# EAGLE design Counting Box (EAGLE 8.5.1)
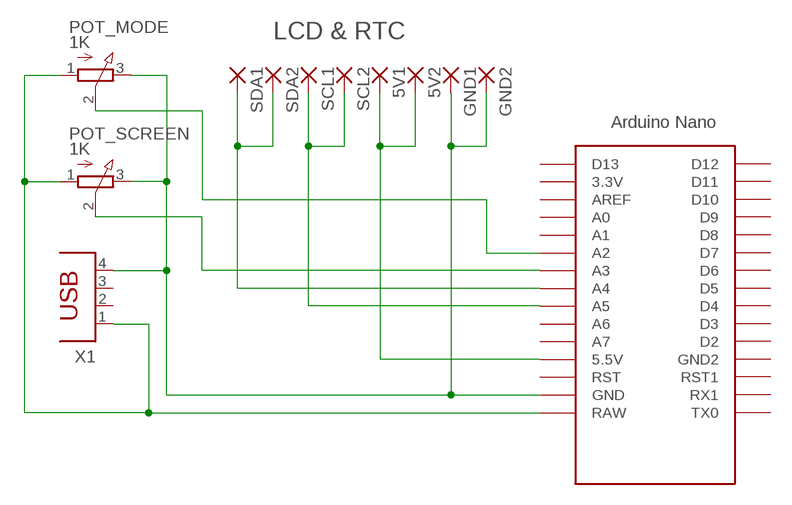
[diagram p0: schematic, sheet 1]

## Parts
5V1  SMD2  [SMD1,27-2,54]
5V2  SMD2  [SMD1,27-2,54]
GND1  SMD2  [SMD1,27-2,54]
GND2  SMD2  [SMD1,27-2,54]
POT_MODE  1K  3RP/1610N  [3RP/1610N]
POT_SCREEN  1K  3RP/1610N  [3RP/1610N]
SCL1  SMD2  [SMD1,27-2,54]
SCL2  SMD2  [SMD1,27-2,54]
SDA1  SMD2  [SMD1,27-2,54]
SDA2  SMD2  [SMD1,27-2,54]
U$1  NANO  [NANO]
X1  PN87520  [PN87520]

## Nets
5V: 5V1.1(P) 5V2.1(P) U$1.5V(5.5V)
GND: GND1.1(P) GND2.1(P) POT_MODE.3(E) POT_SCREEN.3(E) U$1.GND X1.4
POT_MODE: POT_MODE.2(S) U$1.A2
POT_SCREEN: POT_SCREEN.2(S) U$1.A3
SCL: SCL1.1(P) SCL2.1(P) U$1.A5
SDA: SDA1.1(P) SDA2.1(P) U$1.A4
VCC: POT_MODE.1(A) POT_SCREEN.1(A) U$1.RAW X1.1
Unconnected: U$1.3.3V U$1.A0 U$1.A1 U$1.A6 U$1.A7 U$1.AREF U$1.D2 U$1.D3 U$1.D4 U$1.D5 U$1.D6 U$1.D7 U$1.D8 U$1.D9 U$1.D10 U$1.D11 U$1.D12 U$1.D13 U$1.GND1(GND2) U$1.ICSP1 U$1.ICSP2 U$1.ICSP3 U$1.ICSP4 U$1.ICSP5 U$1.ICSP6 U$1.RST U$1.RST1 U$1.RX1 U$1.TX0 X1.2 X1.3

## Notes on the sheet
- LCD & RTC

## Library data of the parts
5V1 5V2 GND1 GND2 SCL1 SCL2 SDA1 SDA2 = wirepad:SMD2: SMD PAD
POT_MODE POT_SCREEN = pot:3RP/1610N: 16mm Potentiometer one level Source: http://www.alphapotentiometers.net/html/16mm_pot_2.html
U$1 = Arduino-clone:NANO: Arduino Nano
X1 = con-berg:PN87520: BERG USB connector; OC_FARNELL: unknown; OC_NEWARK: unknown

## Board
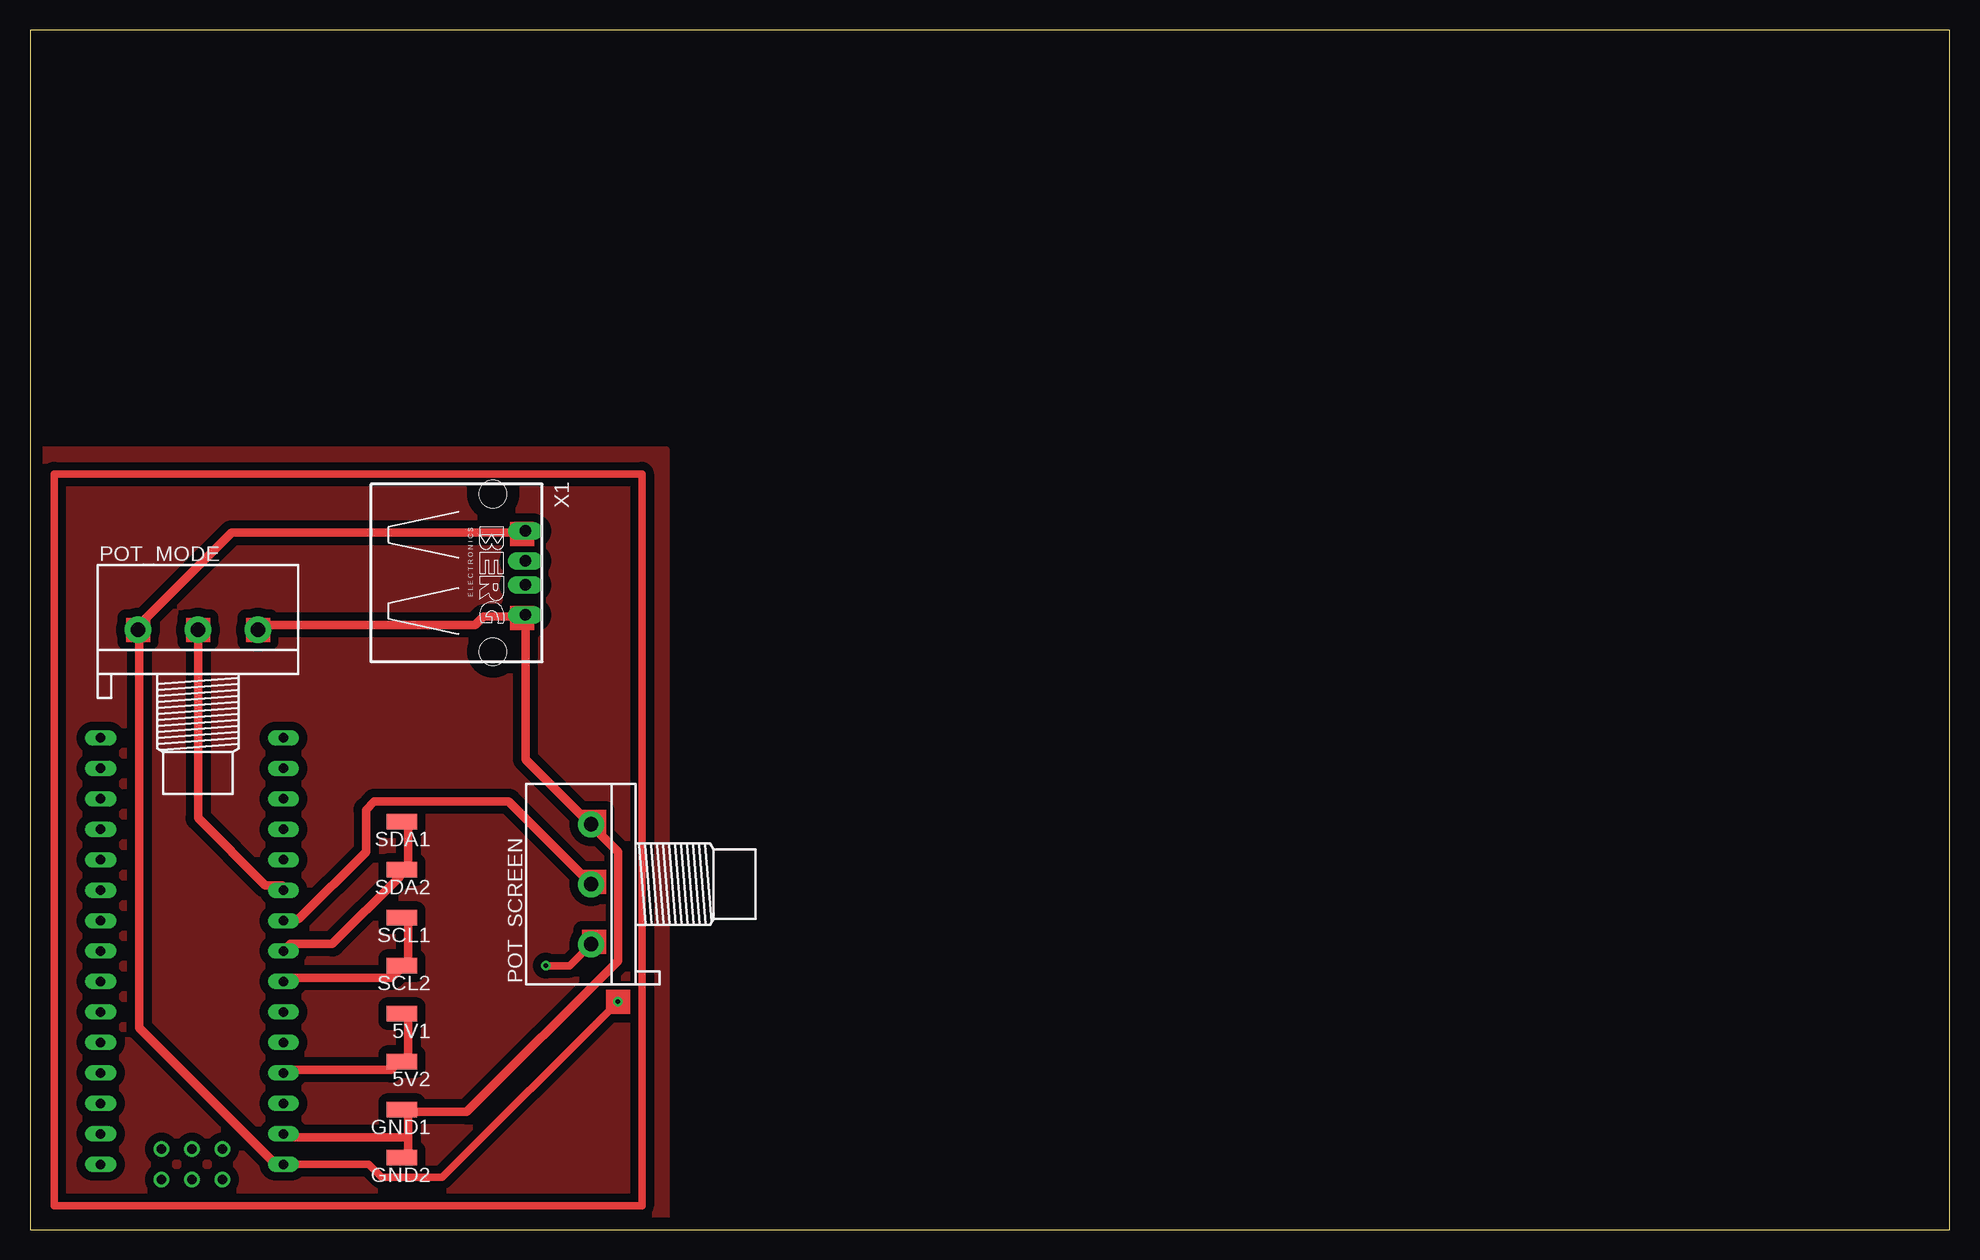
[diagram p1: board, top side]
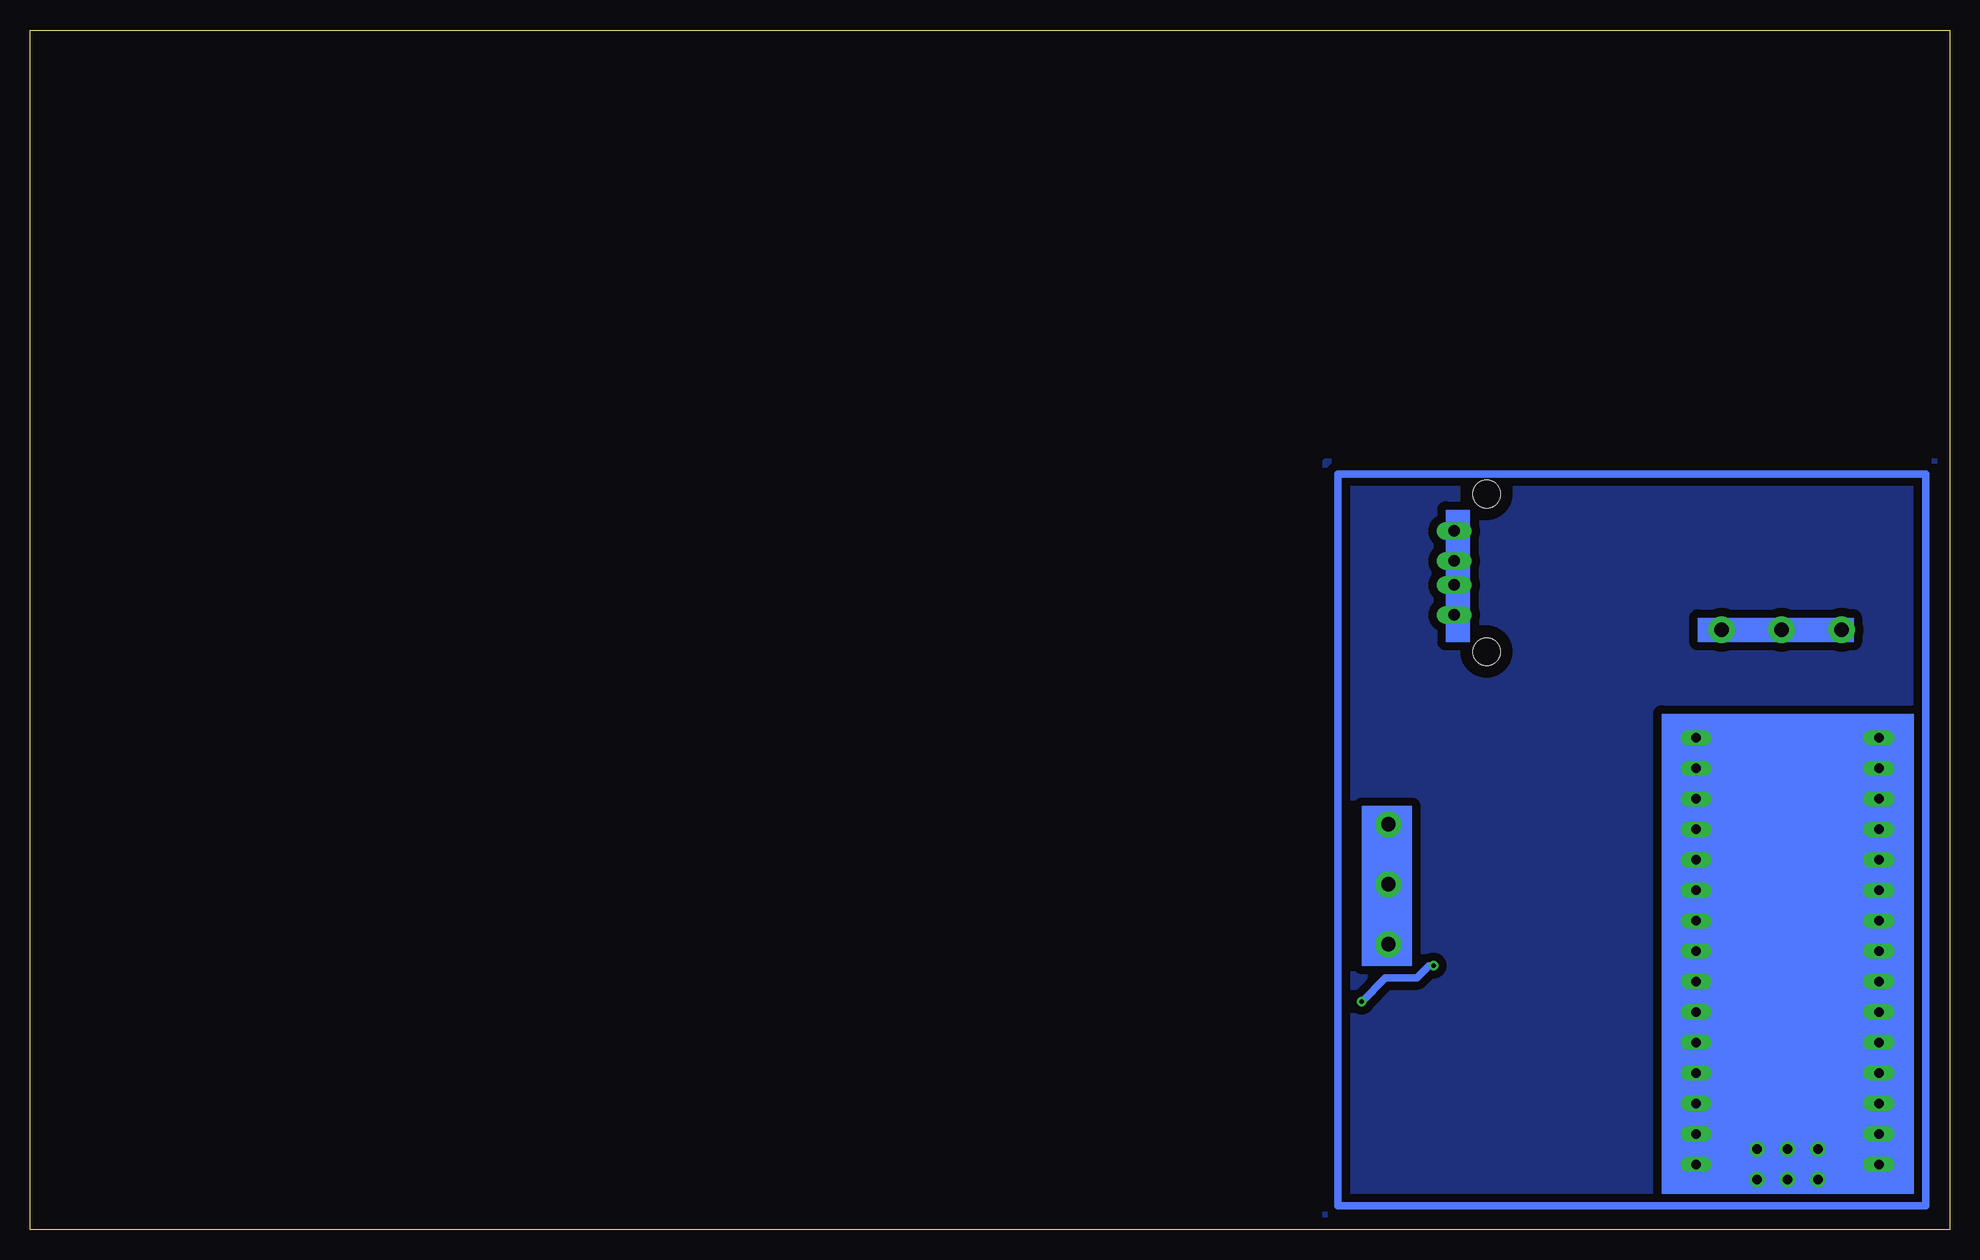
[diagram p2: board, bottom side, seen from below]

Size 160 x 100 mm. Coordinates in mm from the lower left corner, seen from the top.
Outline: 0,0 160,0 160,100 0,100 0,0
Copper layers (1*16): Top 0.035mm / dielectric 1.5mm / Bottom 0.035mm
Design rules "default *": minimum track width 0.7mm, minimum drill 1.5mm, track to track 0.7mm, track to pad 0.7mm, pad to pad 0.7mm, via to via 0.7mm, smd to smd 6mil, copper to edge 40mil, drill to drill 6mil, minimum pad ring 10mil, minimum via ring 8mil, stop-mask expansion 4mil, vias tented up to drill 0mil, thermal gap 10mil

### Footprints (pad centres in the part's own frame; a part is rotated, then mirrored left to right if it is on the bottom)
SMD1,27-2,54 = smd 1.27 x 2.54: 1 0,0
3RP/1610N = drill 1.2 pad 2.184: 1 -5,0; 2 0,0; 3 5,0
NANO = drill 0.8 long: 3.3V -10.16,24.13; 5V -10.16,-1.27; A0 -10.16,19.05; A1 -10.16,16.51; A2 -10.16,13.97; A3 -10.16,11.43; A4 -10.16,8.89; A5 -10.16,6.35; A6 -10.16,3.81; A7 -10.16,1.27; AREF -10.16,21.59; D2 5.08,1.27; D3 5.08,3.81; D4 5.08,6.35; D5 5.08,8.89; D6 5.08,11.43; D7 5.08,13.97; D8 5.08,16.51; D9 5.08,19.05; D10 5.08,21.59; D11 5.08,24.13; D12 5.08,26.67; D13 -10.16,26.67; GND -10.16,-6.35; GND1 5.08,-1.27; RAW -10.16,-8.89; RST -10.16,-3.81; RST1 5.08,-3.81; RX1 5.08,-6.35; TX0 5.08,-8.89 | drill 0.8: ICSP1 -5.08,-10.16; ICSP2 -5.08,-7.62; ICSP3 -2.54,-10.16; ICSP4 -2.54,-7.62; ICSP5 0,-10.16; ICSP6 0,-7.62
PN87520 = drill 0.95 long: 1 -3.5,2.71; 2 -1,2.71; 3 1,2.71; 4 3.5,2.71 | hole 2.3: -6.57,0; 6.57,0

### Placement (x,y rotation side)
5V1  31,18 90 top
5V2  31,14 90 top
GND1  31,10 90 top
GND2  31,6 90 top
POT_MODE  14,50 0 top
POT_SCREEN  46.77,28.78 90 top
SCL1  31,26 90 top
SCL2  31,22 90 top
SDA1  31,34 90 top
SDA2  31,30 90 top
U$1  10.97,14.32 0 bottom
X1  38.59,54.74 270 top

### Tracks (layer width: path | path; a pad name or v marks a point on that pad's centre or on a via)
5V
  Top 0.7: 5V1.1 31.5,17.5 31.5,14 5V2.1 30.8,14 30.1,13.3 21.7,13.3 U$1.5V
GND
  Top 0.7: 31.5,9.8 31.5,7.7 | 31.5,7.7 31.5,6.3 GND2.1 | 31.5,7.7 21.7,7.7 U$1.GND | 41.3,51.1 41.3,39.2 46.2,34.3 POT_SCREEN.3 46.9,33.6 49,31.5 49,22.4 36.4,9.8 31.5,9.8 | 41.3,51.1 37.8,51.1 37.1,50.4 19.6,50.4 POT_MODE.3 | 41.3,51.1 X1.4 | 31.5,9.8 GND1.1
N$1
  Top 0.61: 2,2 2,63 51,63 51,2 2,2
N$2
  Bottom 0.61: 2,2 2,63 51,63 51,2 2,2
N$3
  pour Bottom: 1,1 52,1 52,64 1,64
N$4
  pour Top: 0,0 53,0 53,65 0,65 0,54
POT_MODE
  Top 0.7: POT_MODE.2 14,34.3 19.6,28.7 21,28.7 U$1.A2
POT_SCREEN
  Top 0.7: U$1.A3 21.7,25.9 22.4,25.9 28,31.5 28,35 28.7,35.7 39.9,35.7 46.2,29.4 POT_SCREEN.2
SCL
  Top 0.7: SCL1.1 31.5,25.9 31.5,22.4 SCL2.1 30.8,21.7 30.1,21 21.7,21 U$1.A5
SDA
  Top 0.7: SDA1.1 31.5,33.6 31.5,30.1 SDA2.1 30.8,29.4 25.2,23.8 21.7,23.8 U$1.A4
VCC  (via drill 0.35)
  Top 0.61: U$1.RAW 28.24,5.43 29.31,4.36 34.36,4.36 v49,19 | v43,22 44.99,22 POT_SCREEN.1
  Top 0.7: U$1.RAW 21,5.6 20.3,5.6 9.1,16.8 9.1,49.7 POT_MODE.1 9.1,50.4 16.8,58.1 41.3,58.1 X1.1
  Bottom 0.61: v49,19 47.01,21 44.38,21 43.38,22 v43,22
(copper drawn outside any net)
  shapes: Bottom area x4, Top area x11